# Altium project PD.PrjPcb
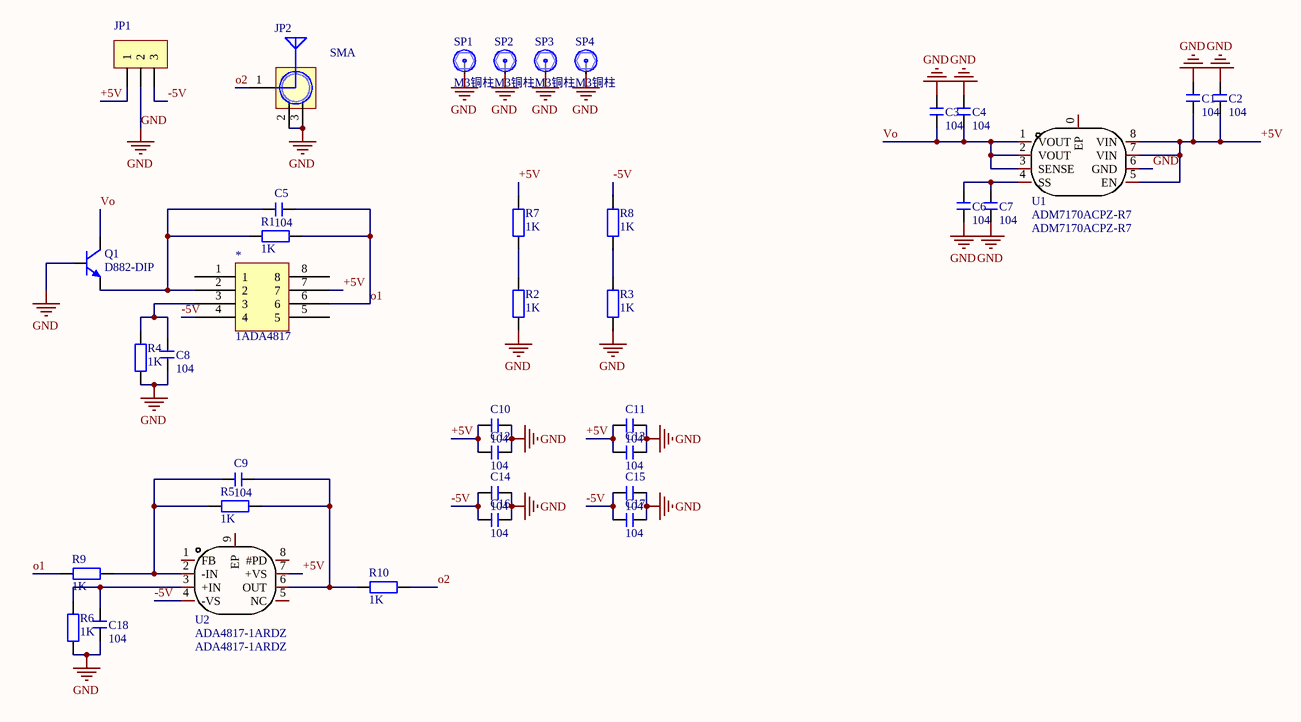
[diagram p0: PD.SchDoc]
1 sheet, 38 parts. Net scope: global (net labels, ports and power ports of the same name join across sheets).
Board files: PD.PcbDoc, PCB1.PcbDoc

## Sheet PD.SchDoc
size A4; SheetNumber: 1; SheetTotal: 1

### Parts
*  1ADA4817  [SOP8_N]
C1  104  [C 0805_L]
C2  104  [C 0805_L]
C3  104  [C 0805_L]
C4  104  [C 0805_L]
C5  104  [C 0805_L]
C6  104  [C 0805_L]
C7  104  [C 0805_L]
C8  104  [C 0805_L]
C9  104  [C 0805_L]
C10  104  [C 0805_L]
C11  104  [C 0805_L]
C12  104  [C 0805_L]
C13  104  [C 0805_L]
C14  104  [C 0805_L]
C15  104  [C 0805_L]
C16  104  [C 0805_L]
C17  104  [C 0805_L]
C18  104  [C 0805_L]
JP1  HDR-1X3  [XH2.54-WI-3P]  (value not drawn)
JP2  SMA  [SMA-KE]
Q1  D882-DIP  [TO92B]
R1  1K  [R 0805_L]
R2  1K  [R 0805_L]
R3  1K  [R 0805_L]
R4  1K  [R 0805_L]
R5  1K  [R 0805_L]
R6  1K  [R 0805_L]
R7  1K  [R 0805_L]
R8  1K  [R 0805_L]
R9  1K  [R 0805_L]
R10  1K  [R 0805_L]
SP1  M3铜柱  [M3x4_L]
SP2  M3铜柱  [M3x4_L]
SP3  M3铜柱  [M3x4_L]
SP4  M3铜柱  [M3x4_L]
U1  ADM7170ACPZ-R7  [LFCSP-8_L3.0-W3.0-P0.50-BL-EP]
U2  ADA4817-1ARDZ  [SOIC-8_L4.9-W3.9-P1.27-LS6.0-BL-EP2.3]

### Nets
GND: C1.2 C2.2 C3.2 C4.2 C6.1 C7.1 C8.1 C10.2 C11.2 C12.2 C13.2 C14.2 C15.2 C16.2 C17.2 C18.1 JP1.2 JP2.2(GND) JP2.3(GND) Q1.3(B) R2.1 R3.1 R4.1 R6.1 SP1.1 SP2.1 SP3.1 SP4.1 U1.6(GND)
+5V: *.7 C1.1 C2.1 C10.1 C11.1 C12.1 C13.1 JP1.1 R7.2 U1.5(EN) U1.7(VIN) U1.8(VIN) U2.7(+VS)
-5V: *.4 C14.1 C15.1 C16.1 C17.1 JP1.3 R8.2 U2.4(-VS)
o1: *.6 C5.2 R1.2 R9.2
o2: JP2.1(ANT) R10.2
Vo: C3.1 C4.1 Q1.2(C) U1.1(VOUT) U1.2(VOUT) U1.3(SENSE)
Net*_2: *.2 C5.1 Q1.1(E) R1.1
Net*_3: *.3 C8.2 R4.2
NetC6_2: C6.2 C7.2 U1.4(SS)
NetC9_1: C9.1 R5.2 R9.1 U2.2(-IN)
NetC9_2: C9.2 R5.1 R10.1 U2.6(OUT)
NetC18_2: C18.2 R6.2 U2.3(+IN)
NetR2_2: R2.2 R7.1
NetR3_2: R3.2 R8.1

Not connected (* = marked no-connect by the designer): * 1 5 8; U1 0(EP); U2 1(FB) 5(NC) 8(#PD) 9(EP)

### Library data of the parts
* = Component_1
C1-C18 = C: 无极性贴片电容; 材质: X7R; BOM名称: 无极性贴片电容
JP1 = Header 3: 3P接插件; BOM名称: 3P接插件
JP2 = SMA: SMA-2.4G射频天线接口; BOM名称: SMA-2.4G射频天线接口
Q1 = D882-DIP: 音频功放-NPN型; 属性: 40V 3A 30W; BOM名称: 音频功放-NPN型
R1-R10 = R: 贴片电阻; BOM名称: 贴片电阻
SP1-SP4 = 铜柱小焊盘: 铜柱; BOM名称: 铜柱
U1 = ADM7170ACPZ-R7: Manufacturer: ADI(亚德诺)/LINEAR(凌特); Add into BOM: yes; Symbol: ADM7170ACPZ-R7; Device: ADM7170ACPZ-R7; LCSC Part Name: ADM7170ACPZ-R7; Supplier Part: C658475; Manufacturer Part: ADM7170ACPZ-R7; Supplier Footprint: LFCSP-8; JLCPCB Part Class: Extended Part; Datasheet: https://atta.szlcsc.comnull; Supplier: LCSC; Convert to PCB: yes; Name: ADM7170ACPZ-R7
U2 = ADA4817-1ARDZ: 运放类型:Voltage Feedback;放大器组数:1;增益带宽积（GBP）:410MHz;压摆率（SR）:870 V/us;电源电压:5V ~ 10V, ±2.5V ~ 5V;各通道供电电流:-;; Manufacturer: ADI(亚德诺)/LINEAR; Add into BOM: yes; Number of Circuits: 1; Gain Bandwidth Product（GBP）: 410MHz; Symbol: ADA4817-1ARDZ; Device: ADA4817-1ARDZ; LCSC Part Name: ADA4817-1ARDZ; Supplier Part: C208248; Manufacturer Part: ADA4817-1ARDZ; Supplier Footprint: SOIC-8_EP_150mil; JLCPCB Part Class: Extended Part; Datasheet: https://atta.szlcsc.com/upload/public/pdf/source/20180424/C208248_B6C816B2B54D5C6B6DFEDEB97F35E3C5.pdf; Supplier: LCSC; Convert to PCB: yes; Amplifier Type: Voltage Feedback; Slew Rate（SR）: 870 V/us; Output Type: -; Supply Voltage（Single）: 5V ~ 10V, ±2.5V ~ 5V; Iq per channel (Typ): -; Operating Temperature: -40°C ~ 105°C; Name: ADA4817-1ARDZ